# Altium schematic sheet Sensors.SchDoc
size A4
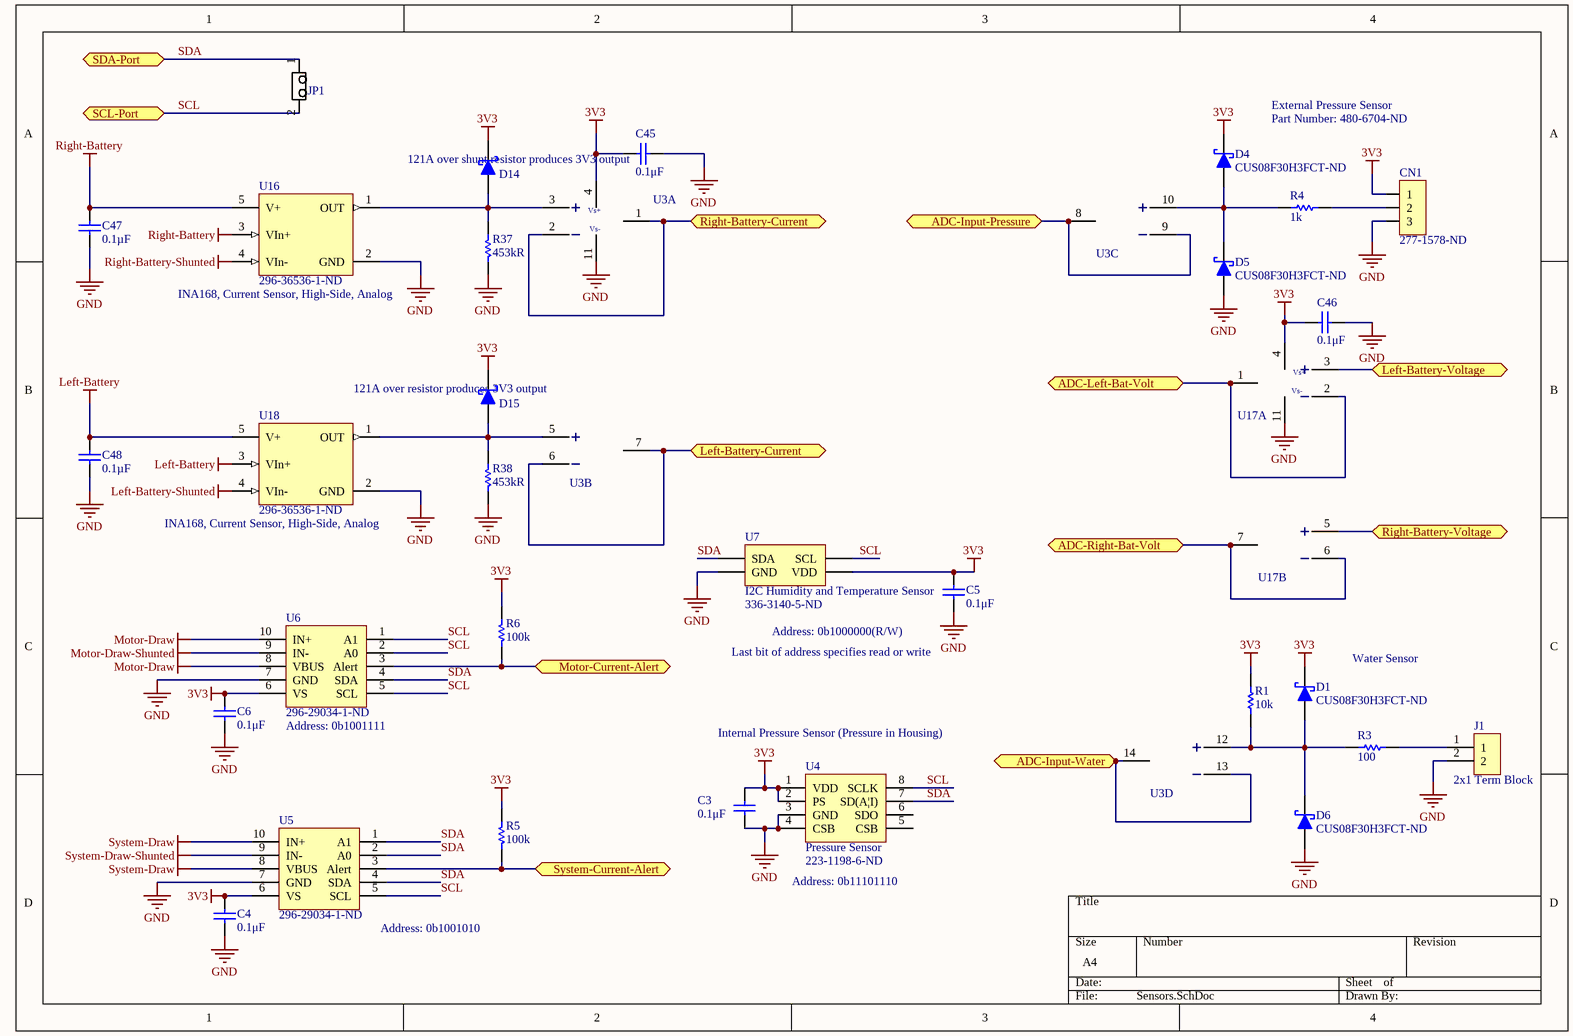
[diagram p0: Sensors.SchDoc]

## Parts
C3  0.1μF  [CAPC1608N(0603")]
C4  0.1μF  [CAPC1608N(0603")]
C5  0.1μF  [CAPC1608N(0603")]
C6  0.1μF  [CAPC1608N(0603")]
C45  0.1μF  [CAPC1608N(0603")]
C46  0.1μF  [CAPC1608N(0603")]
C47  0.1µF  [CAPC2012N(0805")]
C48  0.1µF  [CAPC2012N(0805")]
CN1  Supplier Part Number 1: 277-1578-ND  [3x1, Terminal Block, Pitch: 5mm, Screw, THT]  (hidden comment: 3x1, Terminal Block, Pitch: 5mm, Screw, THT)
D1  CUS08F30H3FCT-ND  [SC-76]
D4  CUS08F30H3FCT-ND  [SC-76]
D5  CUS08F30H3FCT-ND  [SC-76]
D6  CUS08F30H3FCT-ND  [SC-76]
D14  DB2J31400L  [SODFL250X80-2N]  (value not drawn)
D15  DB2J31400L  [SODFL250X80-2N]  (value not drawn)
J1  2x1 Term Block  [2X1 Terminal Blocks]
JP1  1X2 Pin Head  [2X1 Males Header]  (value not drawn)
R1  10k  [RESC1608N(0603")]
R3  100  [RESC1608N(0603")]
R4  1k  [RESC1608N(0603")]
R5  100k  [RESC2012N(0805")]
R6  100k  [RESC2012N(0805")]
R37  453kR  [RESC1608N(0603")]
R38  453kR  [RESC1608N(0603")]
U3  Quad Op Amp LMV324LIPT  [TSSOP14]  (value not drawn)  (parts A,B,C,D of 4)
U4  Pressure Sensor  Supplier Part Number 1: 223-1198-6-ND  [TE Pressure Sensor (MS560702BA03-50)]
U5  Supplier Part Number 2: 296-29034-1-ND  [MSOP-10]  (hidden comment: High side current sensor)
U6  Supplier Part Number 2: 296-29034-1-ND  [MSOP-10]  (hidden comment: High side current sensor)
U7  I2C Humidity and Temperature Sensor  Supplier Part Number 1: 336-3140-5-ND  [QFN-6]
U16  INA168, Current Sensor, High-Side, Analog  Supplier Part Number 1: 296-36536-1-ND  [SOT23-5]
U17  Quad Op Amp LMV324LIPT  [TSSOP14]  (value not drawn)  (parts A,B of 4)
U18  INA168, Current Sensor, High-Side, Analog  Supplier Part Number 1: 296-36536-1-ND  [SOT23-5]

## Ports
ADC-Input-Pressure, ADC-Input-Water, ADC-Left-Bat-Volt, ADC-Right-Bat-Volt, Left-Battery-Current, Left-Battery-Voltage, Motor-Current-Alert, Right-Battery-Current, Right-Battery-Voltage, SCL-Port, SDA-Port, System-Current-Alert

## Nets
3V3: C3.2(Cathode) C4.2(Cathode) C5.2(Cathode) C6.2(Cathode) C45.2(Cathode) C46.2(Cathode) CN1.1 D1.K(Cathode) D4.K(Cathode) D14.1(Cathode) D15.1(Cathode) R1.2 R5.2 R6.2 U3.4(Vcc+) U4.1(VDD) U4.2(PS) U5.6(VS) U6.6(VS) U7.5(VDD) U17.4(Vcc+)
GND: C3.1(Anode) C4.1(Anode) C5.1(Anode) C6.1(Anode) C45.1(Anode) C46.1(Anode) C47.1(Anode) C48.1(Anode) CN1.3 D5.A(Anode) D6.A(Anode) J1.2 R37.1 R38.1 U3.11(Vcc-) U4.3(GND) U4.4(CSB) U5.7(GND) U6.7(GND) U7.2(GND) U16.2(GND) U17.11(Vcc-) U18.2(GND)
Left-Battery: C48.2(Cathode) U18.3(VIn+) U18.5(V+)
Left-Battery-Shunted: U18.4(VIn-)
Motor-Draw: U6.8(VBUS) U6.10(IN+)
Motor-Draw-Shunted: U6.9(IN-)
Right-Battery: C47.2(Cathode) U16.3(VIn+) U16.5(V+)
Right-Battery-Shunted: U16.4(VIn-)
System-Draw: U5.8(VBUS) U5.10(IN+)
System-Draw-Shunted: U5.9(IN-)
ADC-Input-Pressure: U3.8(Output_3) U3.9(Inverting_Input_3) ; port ADC-Input-Pressure
ADC-Input-Water: U3.13(Inverting_Input_3) U3.14(Output_4) ; port ADC-Input-Water
ADC-Left-Bat-Volt: U17.1(Output_1) U17.2(Inverting_Input_1) ; port ADC-Left-Bat-Volt
ADC-Right-Bat-Volt: U17.6(Inverting_Input_2) U17.7(Output_2) ; port ADC-Right-Bat-Volt
Left-Battery-Current: U3.6(Inverting_Input_2) U3.7(Output_2) ; port Left-Battery-Current
Left-Battery-Voltage: U17.3(Non-Inverting_Input_1) ; port Left-Battery-Voltage
Motor-Current-Alert: R6.1 U6.3(Alert) ; port Motor-Current-Alert
Right-Battery-Current: U3.1(Output_1) U3.2(Inverting_Input_1) ; port Right-Battery-Current
Right-Battery-Voltage: U17.5(Non-Inverting_Input_2) ; port Right-Battery-Voltage
SCL: JP1.2 U4.8(SCLK) U5.5(SCL) U6.1(A1) U6.2(A0) U6.5(SCL) U7.6(SCL) ; port SCL-Port
SDA: JP1.1 U4.7(SD(A|I)) U5.1(A1) U5.2(A0) U5.4(SDA) U6.4(SDA) U7.1(SDA) ; port SDA-Port
System-Current-Alert: R5.1 U5.3(Alert) ; port System-Current-Alert
NetCN1_2: CN1.2 R4.2
NetD1_A: D1.A(Anode) D6.K(Cathode) R1.1 R3.1 U3.12(Non-Inverting_Input_4)
NetD4_A: D4.A(Anode) D5.K(Cathode) R4.1 U3.10(Non-Inverting_Input_3)
NetD14_2: D14.2(Anode) R37.2 U3.3(Non-Inverting_Input_1) U16.1(OUT)
NetD15_2: D15.2(Anode) R38.2 U3.5(Non-Inverting_Input_2) U18.1(OUT)
NetJ1_1: J1.1 R3.2

Not connected (* = marked no-connect by the designer): U4 5(CSB) 6(SDO)

## Notes on the sheet
- External Pressure Sensor
- 121A over shunt resistor produces 3V3 output
- Part Number: 480-6704-ND
- 121A over resistor produces 3V3 output
- Last bit of address specifies read or write
- Address: 0b1000000(R/W)
- Water Sensor
- (near U6) Address: 0b1001111
- Internal Pressure Sensor (Pressure in Housing)
- (near U4) Address: 0b11101110
- (near U5) Address: 0b1001010
- (in symbol Quad Op Amp LMV324LIPT, part A) Vs+; Vs-

## Library data of the parts
C3-C6 = 0.1uF 100V 0603 SMD, Ceramic: Capacitor, Ceramic, 100V, +/- 10%, 0603 SMD, X7R; MFG: TDK; MFG#: CGA3E3X7S2A104K080AB; Published: 16-04-26; Publisher: AUVic; PackageDescription: Chip Capacitor; Value: 0.1μF; Created By: Ashwin Sira; Supplier 1: Digi-Key; Supplier Part Number 1: 445-6938-1-ND
C45 C46 = 0.1uF 16V 0603 SMD, Ceramic: Capacitor, Ceramic, 16V, +/- 10%, 0603 SMD, X7R; Published: 16-04-26; Publisher: AUVic; PackageDescription: Chip Capacitor; Value: 0.1μF; Created By: Andy Bates; Supplier 1: Digi-Key; Supplier Part Number 1: 1276-1005-1-ND
C47 C48 = 0.1uF 50V 0805 SMD, Ceramic: Capacitor, Ceramic, 50V, +/-5%, 0805 SMD, X7R; Published: 2016-03-16; Publisher: AUVic; PackageDescription: Chip Capacitor; Value: 0.1µF; Supplier 1: Digi-Key; Supplier Part Number 1: 1276-1090-1-ND
D1 D4-D6 = CUS08F30H3FCT-ND: Diode, Schottky, 30V, 800mA; Created By: Andy Bates; Publisher: AUVic; Date Created: 2016-09-09; Supplier 1: Digi-Key; Supplier Part Number 1: CUS08F30H3FCT-ND
D14 D15 = DB2J31400L: Diode, Schottky, 20V, 30mA; Created By: Ashwin Sira; Publisher: AUVic; Date Created: 2016-06-08; Supplier 1: Digi-Key; Supplier Part Number 1: DB2J31400LCT-ND
J1 = 2x1 Terminal Block: Made by: Andy Bates; Supplier 1: Digikey; Supplier Part Number 1: ED2740-ND
JP1 = 1x2 Male Header: Made By: Andy Bates; Supplier 1: Digikey; Supplier 1 Part Number: 952-3073-ND
R1 = 10kR, 1%, 1/10W, 0603 SMD: Made By: Ashwin Sira; Owned By: AUVic; Created On: 14-05-31; Last Edited: 14-05-31; Supplier 1: Digi-Key; Supplier Part Number 1: 311-10.0KHRCT-ND; Value: 10k
R3 = 100R, 1%, 1/10W, 0603 SMD: Made By: Andy Bates; Owned By: AUVic; Created On: 16-09-10; Last Edited: 16-09-10; Value: 100; Supplier 1: Digi-Key; Supplier Part Number 1: 311-100HRCT-ND
R4 = 1kR, 1%, 1/10W , 0603, SMD: Created By: Andy Bates; Publisher: AUVic; Date Created: 2017-05-10; Value: 1k; Supplier 1: Digikey; Supplier Part Number 1: 311-1.00KHRCT-ND
R5 R6 = 100kR, 1%, 1/4W, 0805 SMD: Made By: Ashwin Sira; Owned By: AUVic; Created On: 14-05-31; Last Edited: 14-05-31; Value: 100k; Supplier 1: Digi-Key; Supplier Part Number 1: 311-1.00MCRCT-ND
R37 R38 = 453kR, 1%, 1/10W, 0603 SMD_1: 453kR, 1%, 1/10W, 0603 SMD; Value: 453kR; Created By: Lyden Smith; Date Created: 2017-10-13; Supplier 1: Digi-Key; Supplier Part Number 1: 311-453KHRDKR-ND
U3 U17 = Quad Op Amp LMV324LIPT: LM324; Created By: Silvano; Creation Date: 05/10/2017; Supplier 1: Digi-Key; Supplier Part Number 1: 497-13053-1-ND
U4 = MS560702BA03-50 Pressure Sensor: 1kPa to 120 kPa; Made by: Andy Bates; Created on: 2017-09-11; Supplier 1: Digi-Key
U5 U6 = INA226AIDGSR, Current Sensor, High Side: 0-36V High side current sensor; Made by: Andy Bates; Created on: 2016-09-06; Supplier 1: Digikey; Supplier 1 Part number: 296-29034-1-ND; Supplier 2: Digi-Key
U7 = Si700XX: Made by: Andy Bates; Supplier 1: Digi-Key; Created on: 2019/09/08
CN1 = 3x1, Terminal Block, Pitch: 5mm, Screw, THT: Publisher: AUVic, Ashwin Sira; Date Published: 2014-06-03; Last Updated: *; Reviewed By: *; Supplier 1: Digi-Key
U16 U18 = INA168, Current Sensor, High-Side, Analog: Created By: Jacob Lower; Publisher: AUVic; Created On: 2016-03-16; Supplier 1: Digi-Key